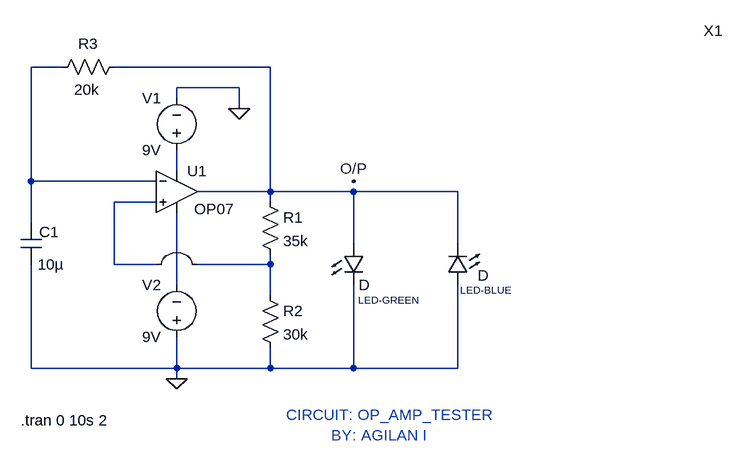
[diagram p0: schematic OP_AMP_TESTER.asc]
OP_AMP_TESTER.asc, the LTspice schematic file:
Version 4
SHEET 1 988 680
WIRE -64 -176 -112 -176
WIRE 256 -176 16 -176
WIRE 208 -144 112 -144
WIRE 112 -128 112 -144
WIRE 208 -112 208 -144
WIRE 112 -16 112 -48
WIRE -112 0 -112 -176
WIRE 80 0 -112 0
WIRE 256 16 256 -176
WIRE 256 16 144 16
WIRE 384 16 256 16
WIRE 544 16 384 16
WIRE 80 32 16 32
WIRE 256 32 256 16
WIRE -112 64 -112 0
WIRE 384 96 384 16
WIRE 544 96 544 16
WIRE 16 128 16 32
WIRE 80 128 16 128
WIRE 256 128 256 112
WIRE 256 128 144 128
WIRE 112 160 112 48
WIRE 256 176 256 128
WIRE -112 288 -112 128
WIRE 112 288 112 240
WIRE 112 288 -112 288
WIRE 256 288 256 256
WIRE 256 288 112 288
WIRE 384 288 384 160
WIRE 384 288 256 288
WIRE 544 288 544 160
WIRE 544 288 384 288
WIRE 112 304 112 288
FLAG 112 304 0
FLAG 208 -112 0
FLAG 384 0 O/P
SYMBOL Opamps\\OP07 112 -48 R0
WINDOW 3 27 91 Left 2
SYMATTR InstName U1
SYMBOL LED 368 96 R0
WINDOW 0 23 87 Left 1
SYMATTR InstName LED-GREEN
SYMBOL LED 560 160 R180
WINDOW 0 -66 -7 Left 1
WINDOW 3 -32 15 Left 2
SYMATTR InstName LED-BLUE
SYMBOL res 240 16 R0
SYMATTR InstName R1
SYMATTR Value 35k
SYMBOL res 240 160 R0
SYMATTR InstName R2
SYMATTR Value 30k
SYMBOL res 32 -192 R90
WINDOW 0 -4 56 VBottom 2
WINDOW 3 35 58 VTop 2
SYMATTR InstName R3
SYMATTR Value 20k
SYMBOL Misc\\jumper 112 64 R0
WINDOW 0 825 -280 Bottom 2
SYMATTR InstName X1
SYMBOL cap -128 64 R0
WINDOW 0 28 14 Left 2
WINDOW 3 26 64 Left 2
SYMATTR InstName C1
SYMATTR Value 10µ
SYMBOL voltage 112 -32 R180
WINDOW 0 24 96 Left 2
WINDOW 3 24 16 Left 2
WINDOW 123 0 0 Left 0
WINDOW 39 0 0 Left 0
SYMATTR InstName V1
SYMATTR Value 9V
SYMBOL voltage 112 256 R180
WINDOW 0 24 96 Left 2
WINDOW 3 24 16 Left 2
WINDOW 123 0 0 Left 0
WINDOW 39 0 0 Left 0
SYMATTR InstName V2
SYMATTR Value 9V
TEXT -128 368 Left 2 !.tran 0 10s 2
TEXT 280 360 Left 2 ;CIRCUIT: OP_AMP_TESTER\n          BY: AGILAN I

The netlist it stands for:
* OP_AMP_TESTER.asc
XU1 N004 N001 N003 N005 N002 LT1001  ; OP07, pins In+ In- V+ V- OUT
D§LED-GREEN N002 0 D
D§LED-BLUE 0 N002 D
R1 N002 N004 35k
R2 N004 0 30k
R3 N002 N001 20k
C1 N001 0 10µ
V1 N003 0 9V
V2 0 N005 9V
.model D D
.lib standard.dio
.tran 0 10s 2
* CIRCUIT: OP_AMP_TESTER
*           BY: AGILAN I
.lib LTC.lib
.backanno
.end